# EAGLE schematic motor mbed (EAGLE 9.6.2)
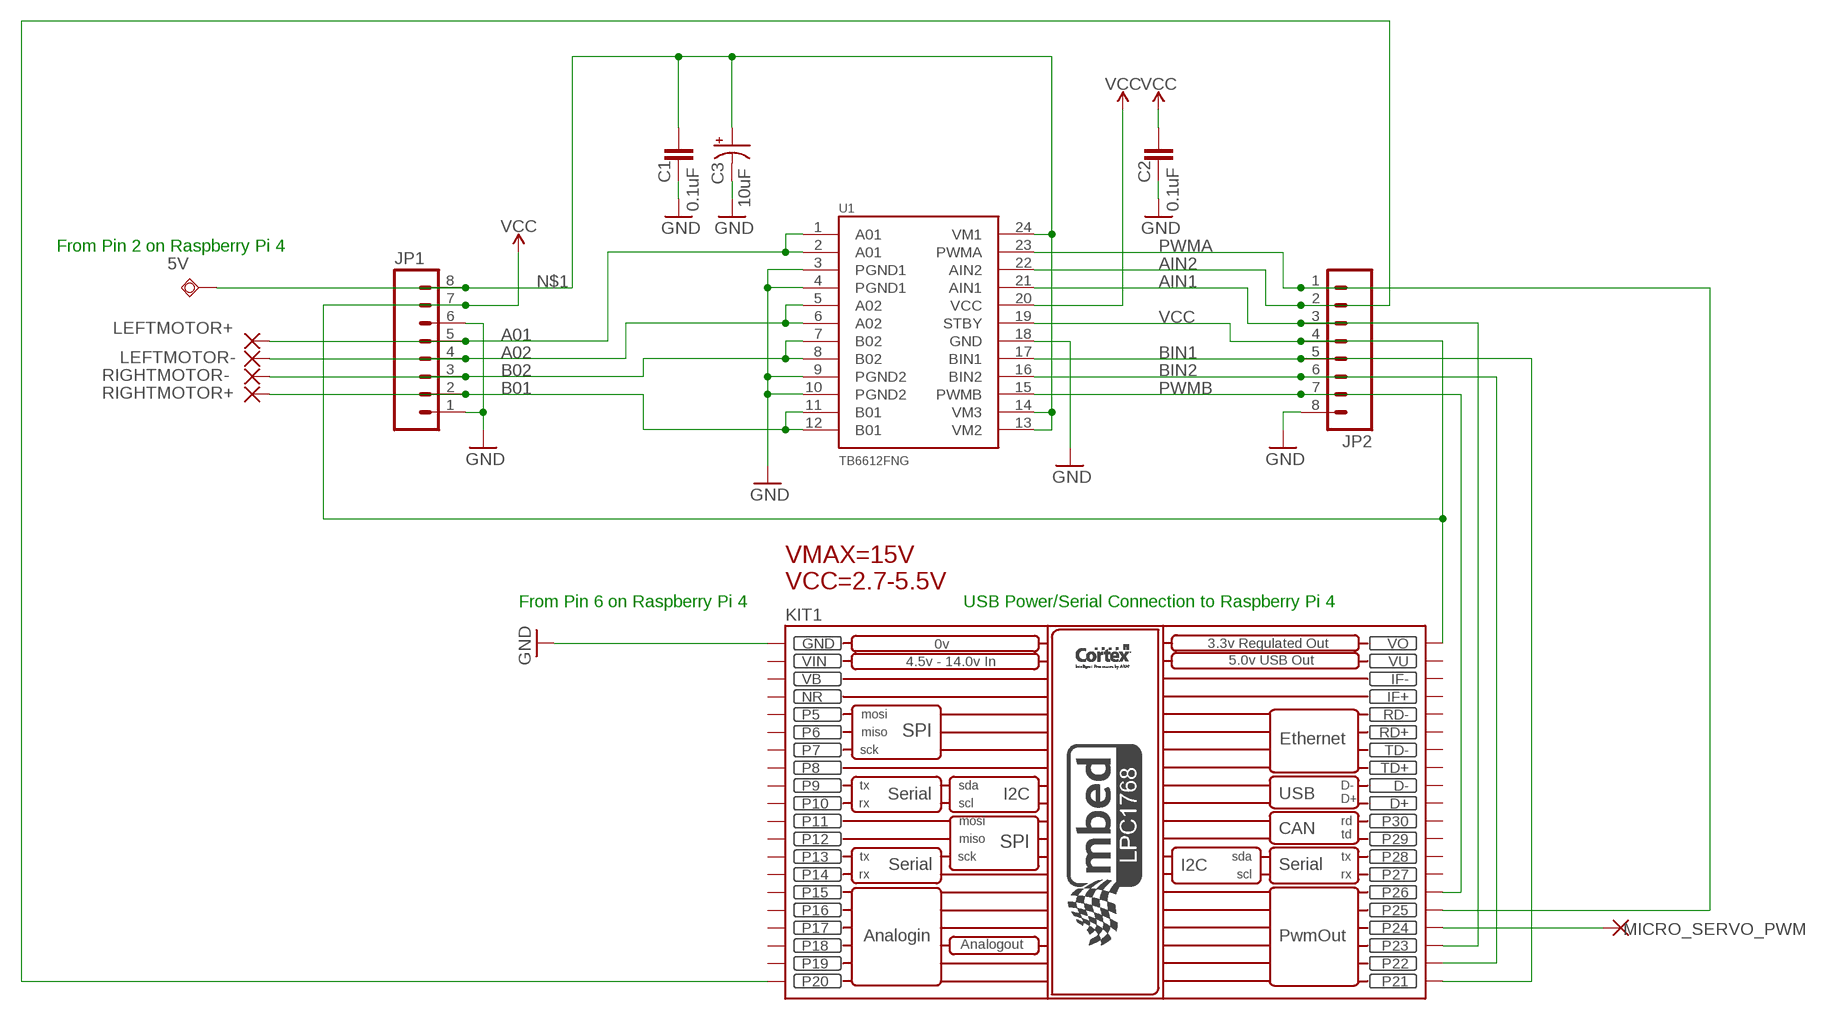
[diagram p0: schematic, sheet 1]

## Parts
5V  TPSQPAD1-20  [P1-20]
C1  0.1uF  0.1UF-0402-16V-10%  [0402]
C2  0.1uF  0.1UF-0402-16V-10%  [0402]
C3  10uF  10UF-POLAR-EIA3528-20V-10%(TANT)  [EIA3528]
JP1  M0875_PERCENT_REDUCED  [1X08_OFFSET_REDUCED]
JP2  M0875_PERCENT_REDUCED  [1X08_OFFSET_REDUCED]
KIT1  MBED_NXP_LPC1768  [MBED-KIT]
LEFTMOTOR+  WIREPAD2,54/1,1  [2,54/1,1]
LEFTMOTOR-  WIREPAD2,54/1,1  [2,54/1,1]
MICRO_SERVO_PWM  WIREPAD2,54/1,1  [2,54/1,1]
RIGHTMOTOR+  WIREPAD2,54/1,1  [2,54/1,1]
RIGHTMOTOR-  WIREPAD2,54/1,1  [2,54/1,1]
U1  TB6612FNG  [SSOP24]

## Nets
A01: JP1.5 LEFTMOTOR+.1(P) U1.1(A01) U1.2(A01)
A02: JP1.4 LEFTMOTOR-.1(P) U1.5(A02) U1.6(A02)
AIN1: JP2.3 KIT1.P$23(P23) U1.21(AIN1)
AIN2: JP2.2 KIT1.P$20(P20) U1.22(AIN2)
B01: JP1.2 RIGHTMOTOR+.1(P) U1.11(B01) U1.12(B01)
B02: JP1.3 RIGHTMOTOR-.1(P) U1.7(B02) U1.8(B02)
BIN1: JP2.5 KIT1.P$21(P21) U1.17(BIN1)
BIN2: JP2.6 KIT1.P$22(P22) U1.16(BIN2)
GND: C1.2 C2.2 C3.C(-) JP1.1 JP1.6 JP2.8 KIT1.GND U1.3(PGND1) U1.4(PGND1) U1.9(PGND2) U1.10(PGND2) U1.18(GND)
N$1: 5V.TP C1.1 C3.A(+) JP1.8 U1.13(VM2) U1.14(VM3) U1.24(VM1)
N$2: KIT1.P$24(P24) MICRO_SERVO_PWM.1(P)
PWMA: JP2.1 KIT1.P$25(P25) U1.23(PWMA)
PWMB: JP2.7 KIT1.P$26(P26) U1.15(PWMB)
VCC: C2.1 JP1.7 JP2.4 KIT1.VOUT(VO) U1.19(STBY) U1.20(VCC)
Unconnected: KIT1.D+ KIT1.D- KIT1.IF+ KIT1.IF- KIT1.P$5(P5) KIT1.P$6(P6) KIT1.P$7(P7) KIT1.P$8(P8) KIT1.P$9(P9) KIT1.P$10(P10) KIT1.P$11(P11) KIT1.P$12(P12) KIT1.P$13(P13) KIT1.P$14(P14) KIT1.P$15(P15) KIT1.P$16(P16) KIT1.P$17(P17) KIT1.P$18(P18) KIT1.P$19(P19) KIT1.P$27(P27) KIT1.P$28(P28) KIT1.P$29(P29) KIT1.P$30(P30) KIT1.RD+ KIT1.RD- KIT1.TD+ KIT1.TD-

## Notes on the sheet
- From Pin 2 on Raspberry Pi 4
- VMAX=15V
  VCC=2.7-5.5V
- From Pin 6 on Raspberry Pi 4 | USB Power/Serial Connection to Raspberry Pi 4

## Power pins joined to a net without a drawn wire
NR: KIT1.NR
VB: KIT1.VB
VIN: KIT1.VIN
VU: KIT1.VU

## Library data of the parts
5V = testpad:TPSQ: Test pad
C1 C2 = SparkFun-Capacitors:0.1UF: 0.1µF ceramic capacitors A capacitor is a passive two-terminal electrical component used to store electrical energy temporarily in an electric field.; PROD_ID: CAP-12416
C3 = SparkFun-Capacitors:10UF-POLAR: 10.0µF polarized capacitors A capacitor is a passive two-terminal electrical component used to store electrical energy temporarily in an electric field.; PROD_ID: CAP-08063
JP1 JP2 = Testing:M08: Header 8 Standard 8-pin 0.1" header. Use with straight break away headers (SKU : PRT-00116), right angle break away headers (PRT-00553), swiss pins (PRT-00743), machine pins (PRT-00117), and female headers (PRT-00115).
KIT1 = MBED_v2.1:MBED_NXP_LPC1768: Mbed LPC1768 - ARM CORTEX v2.1 * Schematic symbol is now placed in eagles's default raster. *The pads diameter are suitable for routing between mbed pins * mbed pads are 0.8 mm drill diameter. --------------------------------------------- Created by: Mohamed Yousry *Alexandria, Egypt *Email: mohamed.yousry@ieeegoldegypt.org
LEFTMOTOR+ LEFTMOTOR- MICRO_SERVO_PWM RIGHTMOTOR+ RIGHTMOTOR- = wirepad:WIREPAD: Wire PAD connect wire on PCB
U1 = SparkFun-IC-Special-Function:TB6612FNG: Toshiba 1A dual motor driver IC-09363; PROD_ID: IC-09363